# Altium schematic sheet SYS.SchDoc
size A4
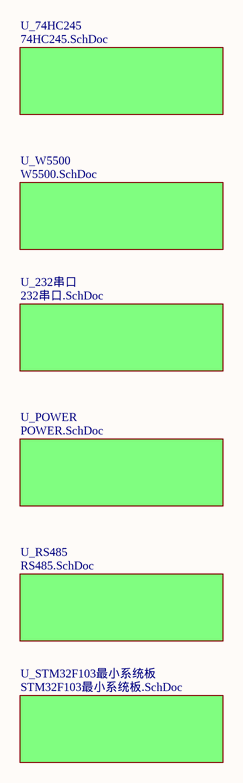
[diagram p0: SYS.SchDoc]

## Sub-sheets
U_74HC245 = 74HC245.SchDoc: no entries
U_232串口 = 232串口.SchDoc: no entries
U_POWER = POWER.SchDoc: no entries
U_RS485 = RS485.SchDoc: no entries
U_STM32F103最小系统板 = STM32F103最小系统板.SchDoc: no entries
U_W5500 = W5500.SchDoc: no entries